# Altium schematic sheet Sensor.SchDoc: Sensor
size A4; Organization: Altium Limited; Address1: L3, 12a Rodborough Rd; Address2: Frenchs Forest; Address3: NSW; Address4: Australia 2086
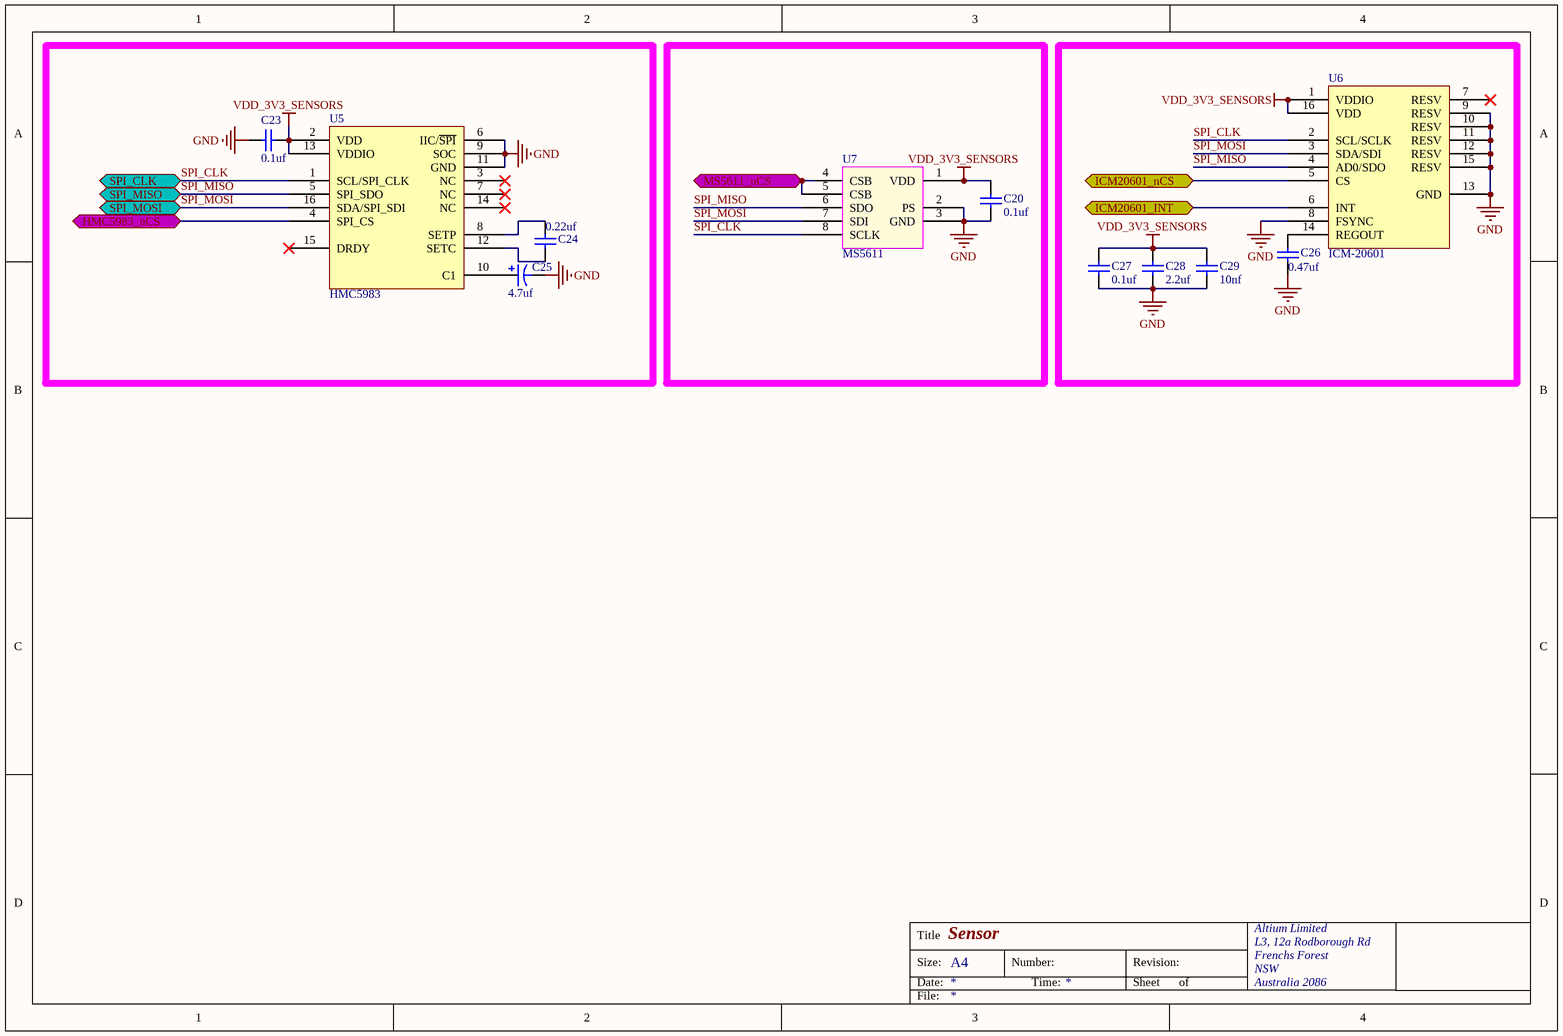
[diagram p0: Sensor.SchDoc]

## Parts
C20  value 0.1uf  [0603AC]  (hidden comment: Cap1)
C23  value 0.1uf  [0603AC]  (hidden comment: Cap1)
C24  value 0.22uf  [0603AC]  (hidden comment: Cap1)
C25  value 4.7uf  [0603AC]  (hidden comment: Cap Pol1)
C26  value 0.47uf  [0603AC]  (hidden comment: Cap1)
C27  value 0.1uf  [0603AC]  (hidden comment: Cap1)
C28  value 2.2uf  [0603AC]  (hidden comment: Cap1)
C29  value 10nf  [0603AC]  (hidden comment: Cap1)
U5  HMC5983  [LPCC-16PIN]
U6  ICM-20601  [LGA-16PIN]
U7  MS5611  [MS5611]

## Ports
HMC5983_nCS, ICM20601_INT, ICM20601_nCS, MS5611_nCS, SPI_CLK, SPI_MISO, SPI_MOSI

## Nets
GND: C20.2 C23.2 C25.2 C26.1 C27.2 C28.2 C29.2 U5.6(IIC/~{SPI}) U5.9(SOC) U5.11(GND) U6.8(FSYNC) U6.9(RESV) U6.10(RESV) U6.11(RESV) U6.12(RESV) U6.13(GND) U6.15(RESV) U7.2(PS) U7.3(GND)
VDD_3V3_SENSORS: C20.1 C23.1 C27.1 C28.1 C29.1 U5.2(VDD) U5.13(VDDIO) U6.1(VDDIO) U6.16(VDD) U7.1(VDD)
HMC5983_nCS: U5.4(SPI_CS) ; port HMC5983_nCS
ICM20601_INT: U6.6(INT) ; port ICM20601_INT
ICM20601_nCS: U6.5(CS) ; port ICM20601_nCS
MS5611_nCS: U7.4(CSB) U7.5(CSB) ; port MS5611_nCS
SPI_CLK: U5.1(SCL/SPI_CLK) U6.2(SCL/SCLK) U7.8(SCLK) ; port SPI_CLK
SPI_MISO: U5.5(SPI_SDO) U6.4(AD0/SDO) U7.6(SDO) ; port SPI_MISO
SPI_MOSI: U5.16(SDA/SPI_SDI) U6.3(SDA/SDI) U7.7(SDI) ; port SPI_MOSI
NetC24_1: C24.1 U5.12(SETC)
NetC24_2: C24.2 U5.8(SETP)
NetC25_1: C25.1 U5.10(C1)
NetC26_2: C26.2 U6.14(REGOUT)

Not connected (* = marked no-connect by the designer): U5 3(NC)* 7(NC)* 14(NC)* 15(DRDY)*; U6 7(RESV)*

## Notes on the sheet
- Title
- Size:
- Date:
- A4
- Number:
- Time:
- Revision:
- Sheet
- of
- File:

## Library data of the parts
C20 C23 C24 C26-C29 = Cap1: Capacitor; Published: 8-Jun-2000; LatestRevisionDate: 17-Jul-2002; LatestRevisionNote: Re-released for DXP Platform.; PackageReference: RAD-0.3; Publisher: Altium Limited; PackageDescription: Radial Cap, Thru-Hole; 2 Leads; 0.3 in Pin Spacing
C25 = Cap Pol1: Polarized Capacitor (Axial); Published: 8-Jun-2000; LatestRevisionDate: 17-Jul-2002; LatestRevisionNote: Re-released for DXP Platform.; PackageReference: POLAR0.8; Publisher: Altium Limited; PackageDescription: Polarized Capacitor; 2 Leads